# Altium schematic sheet bobcat.SchDoc
size A2
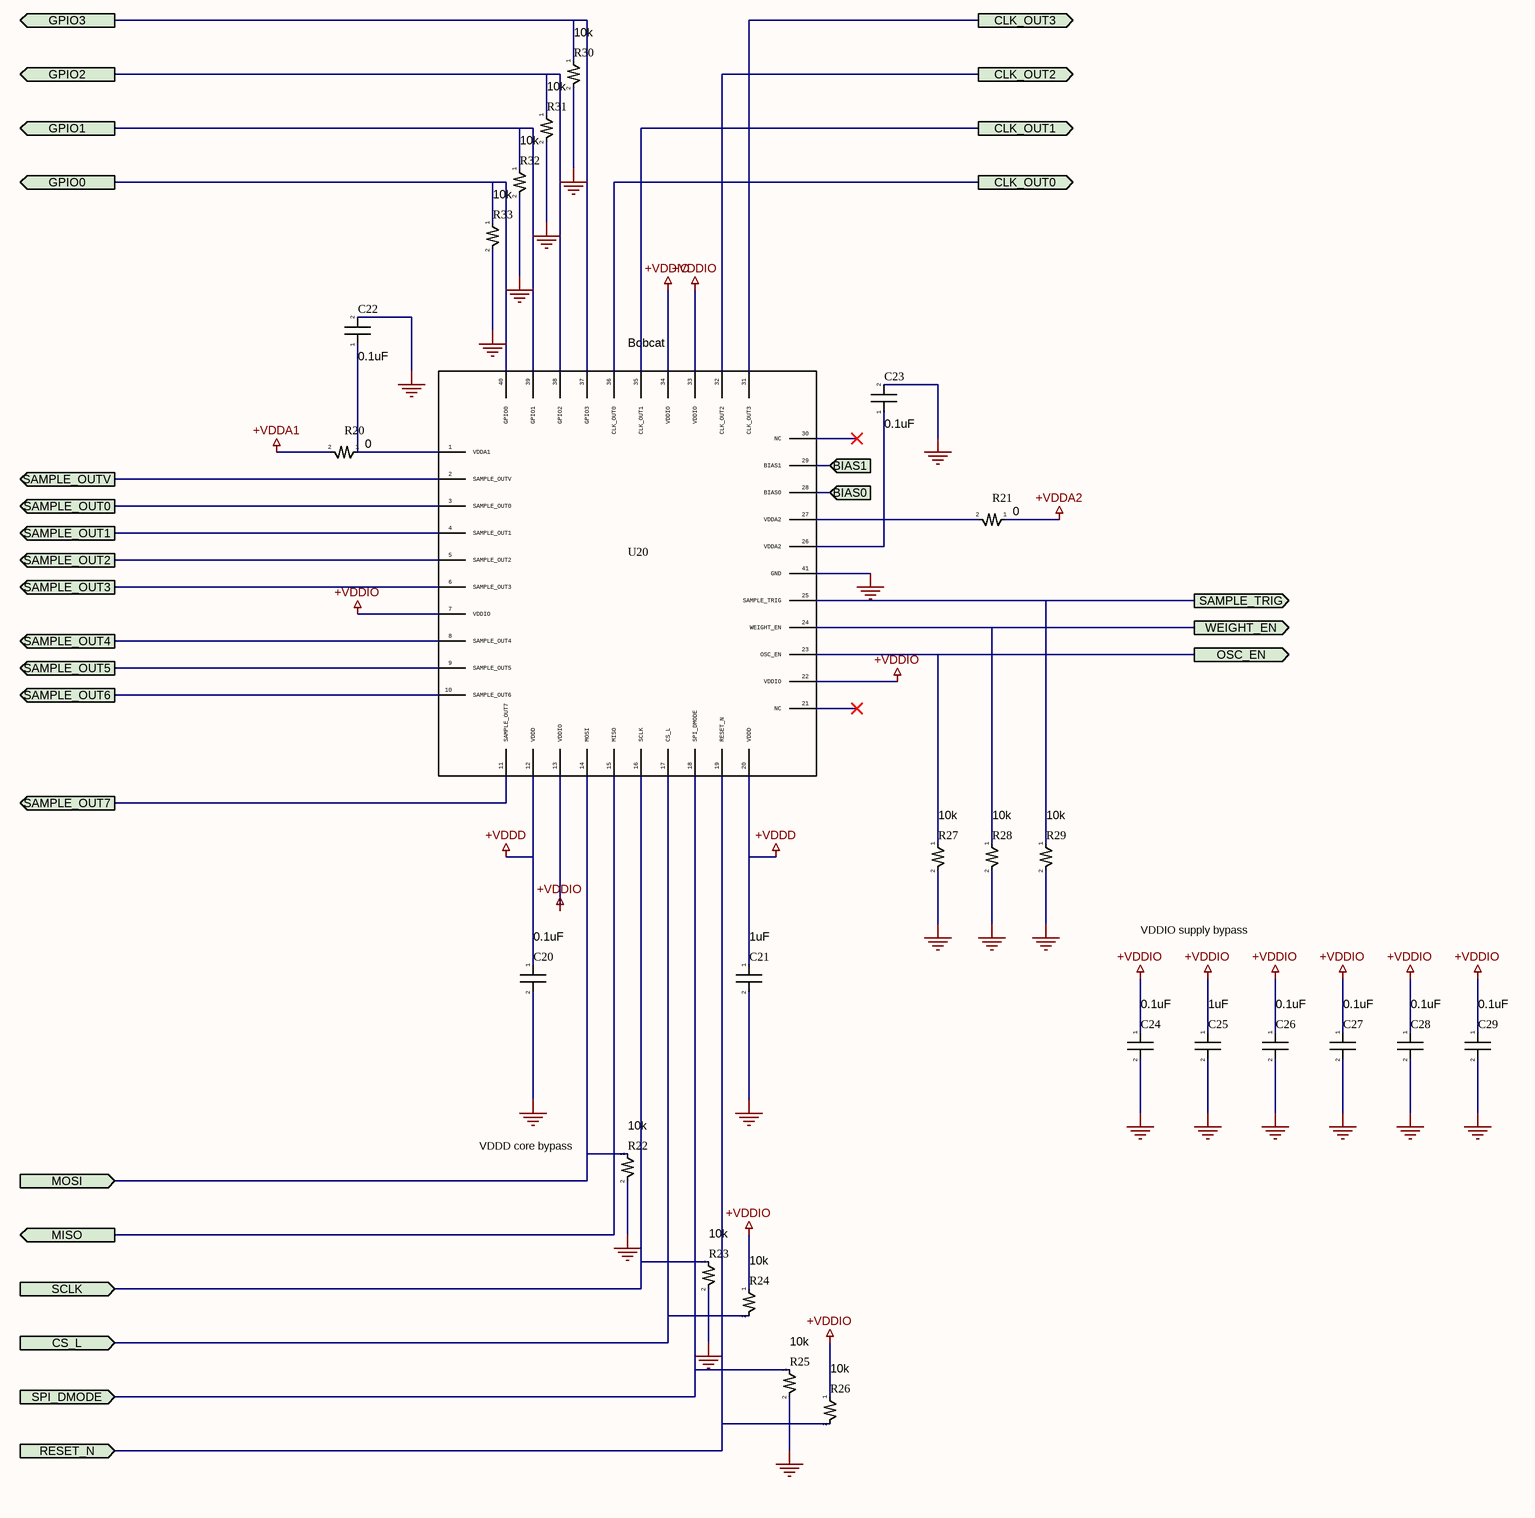
[diagram p0: bobcat.SchDoc]

## Parts
C20  0.1uF
C21  1uF
C22  0.1uF
C23  0.1uF
C24  0.1uF
C25  1uF
C26  0.1uF
C27  0.1uF
C28  0.1uF
C29  0.1uF
R20  0
R21  0
R22  10k
R23  10k
R24  10k
R25  10k
R26  10k
R27  10k
R28  10k
R29  10k
R30  10k
R31  10k
R32  10k
R33  10k
U20  Bobcat

## Ports
BIAS0 (in), BIAS1 (in), CLK_OUT0 (out), CLK_OUT1 (out), CLK_OUT2 (out), CLK_OUT3 (out), CS_L (in), GPIO0 (out), GPIO1 (out), GPIO2 (out), GPIO3 (out), MISO (out), MOSI (in), OSC_EN (out), RESET_N (in), SAMPLE_OUT0 (out), SAMPLE_OUT1 (out), SAMPLE_OUT2 (out), SAMPLE_OUT3 (out), SAMPLE_OUT4 (out), SAMPLE_OUT5 (out), SAMPLE_OUT6 (out), SAMPLE_OUT7 (out), SAMPLE_OUTV (out), SAMPLE_TRIG (out), SCLK (in), SPI_DMODE (in), WEIGHT_EN (out)

## Nets
+VDDA1: R20.2
+VDDA2: R21.1
+VDDD: C20.1 C21.1 U20.12(VDDD) U20.20(VDDD)
+VDDIO: C24.1 C25.1 C26.1 C27.1 C28.1 C29.1 R24.1 R26.1 U20.7(VDDIO) U20.13(VDDIO) U20.22(VDDIO) U20.33(VDDIO) U20.34(VDDIO)
GND: C20.2 C21.2 C22.2 C23.2 C24.2 C25.2 C26.2 C27.2 C28.2 C29.2 R22.2 R23.2 R25.2 R27.2 R28.2 R29.2 R30.2 R31.2 R32.2 R33.2 U20.41(GND)
BIAS0: U20.28(BIAS0) ; port BIAS0
BIAS1: U20.29(BIAS1) ; port BIAS1
CLK_OUT0: U20.36(CLK_OUT0) ; port CLK_OUT0
CLK_OUT1: U20.35(CLK_OUT1) ; port CLK_OUT1
CLK_OUT2: U20.32(CLK_OUT2) ; port CLK_OUT2
CLK_OUT3: U20.31(CLK_OUT3) ; port CLK_OUT3
CS_L: R24.2 U20.17(CS_L) ; port CS_L
GPIO0: R33.1 U20.40(GPIO0) ; port GPIO0
GPIO1: R32.1 U20.39(GPIO1) ; port GPIO1
GPIO2: R31.1 U20.38(GPIO2) ; port GPIO2
GPIO3: R30.1 U20.37(GPIO3) ; port GPIO3
MISO: U20.15(MISO) ; port MISO
MOSI: R22.1 U20.14(MOSI) ; port MOSI
OSC_EN: R27.1 U20.23(OSC_EN) ; port OSC_EN
RESET_N: R26.2 U20.19(RESET_N) ; port RESET_N
SAMPLE_OUT0: U20.3(SAMPLE_OUT0) ; port SAMPLE_OUT0
SAMPLE_OUT1: U20.4(SAMPLE_OUT1) ; port SAMPLE_OUT1
SAMPLE_OUT2: U20.5(SAMPLE_OUT2) ; port SAMPLE_OUT2
SAMPLE_OUT3: U20.6(SAMPLE_OUT3) ; port SAMPLE_OUT3
SAMPLE_OUT4: U20.8(SAMPLE_OUT4) ; port SAMPLE_OUT4
SAMPLE_OUT5: U20.9(SAMPLE_OUT5) ; port SAMPLE_OUT5
SAMPLE_OUT6: U20.10(SAMPLE_OUT6) ; port SAMPLE_OUT6
SAMPLE_OUT7: U20.11(SAMPLE_OUT7) ; port SAMPLE_OUT7
SAMPLE_OUTV: U20.2(SAMPLE_OUTV) ; port SAMPLE_OUTV
SAMPLE_TRIG: R29.1 U20.25(SAMPLE_TRIG) ; port SAMPLE_TRIG
SCLK: R23.1 U20.16(SCLK) ; port SCLK
SPI_DMODE: R25.1 U20.18(SPI_DMODE) ; port SPI_DMODE
WEIGHT_EN: R28.1 U20.24(WEIGHT_EN) ; port WEIGHT_EN
NetC22_1: C22.1 R20.1 U20.1(VDDA1)
NetC23_1: C23.1 R21.2 U20.26(VDDA2) U20.27(VDDA2)

Not connected (* = marked no-connect by the designer): U20 21(NC)* 30(NC)*

## Notes on the sheet
- VDDIO supply bypass
- VDDD core bypass

## Library data of the parts
C20 C22-C24 C26-C29 = GRM155R71C104KA88D: CAP CER 0.1UF 16V X7R 0402; Manufacturer_Name: Murata; Manufacturer_Part_Number: GRM155R71C104KA88D
C21 C25 = GRM155R70J105KA12D: Manufacturer_Name: Murata; Manufacturer_Part_Number: GRM155R70J105KA12D
R20 R21 = CRCW04020000Z0ED: D10/CRCW0402 0R0 ET7 e3; Manufacturer_Name: Vishay; Manufacturer_Part_Number: CRCW04020000Z0ED
R22-R33 = CR0402-FX-1002GLF: Manufacturer_Name: Bourns Electronics; Manufacturer_Part_Number: CR0402-FX-1002GLF
U20 = Bobcat: Bobcat mixed-signal test chip — 40-QFN, 5x5 mm, 0.4 mm pitch, exposed GND pad (41); Manufacturer: Unconventional AI; Value: Bobcat; Footprint: Bobcat:QFN-40_5x5mm_P0.4mm_EP3.5mm; MPN: Bobcat